# Altium project SLAVE_HW.PrjPcb (part 1 of 2)
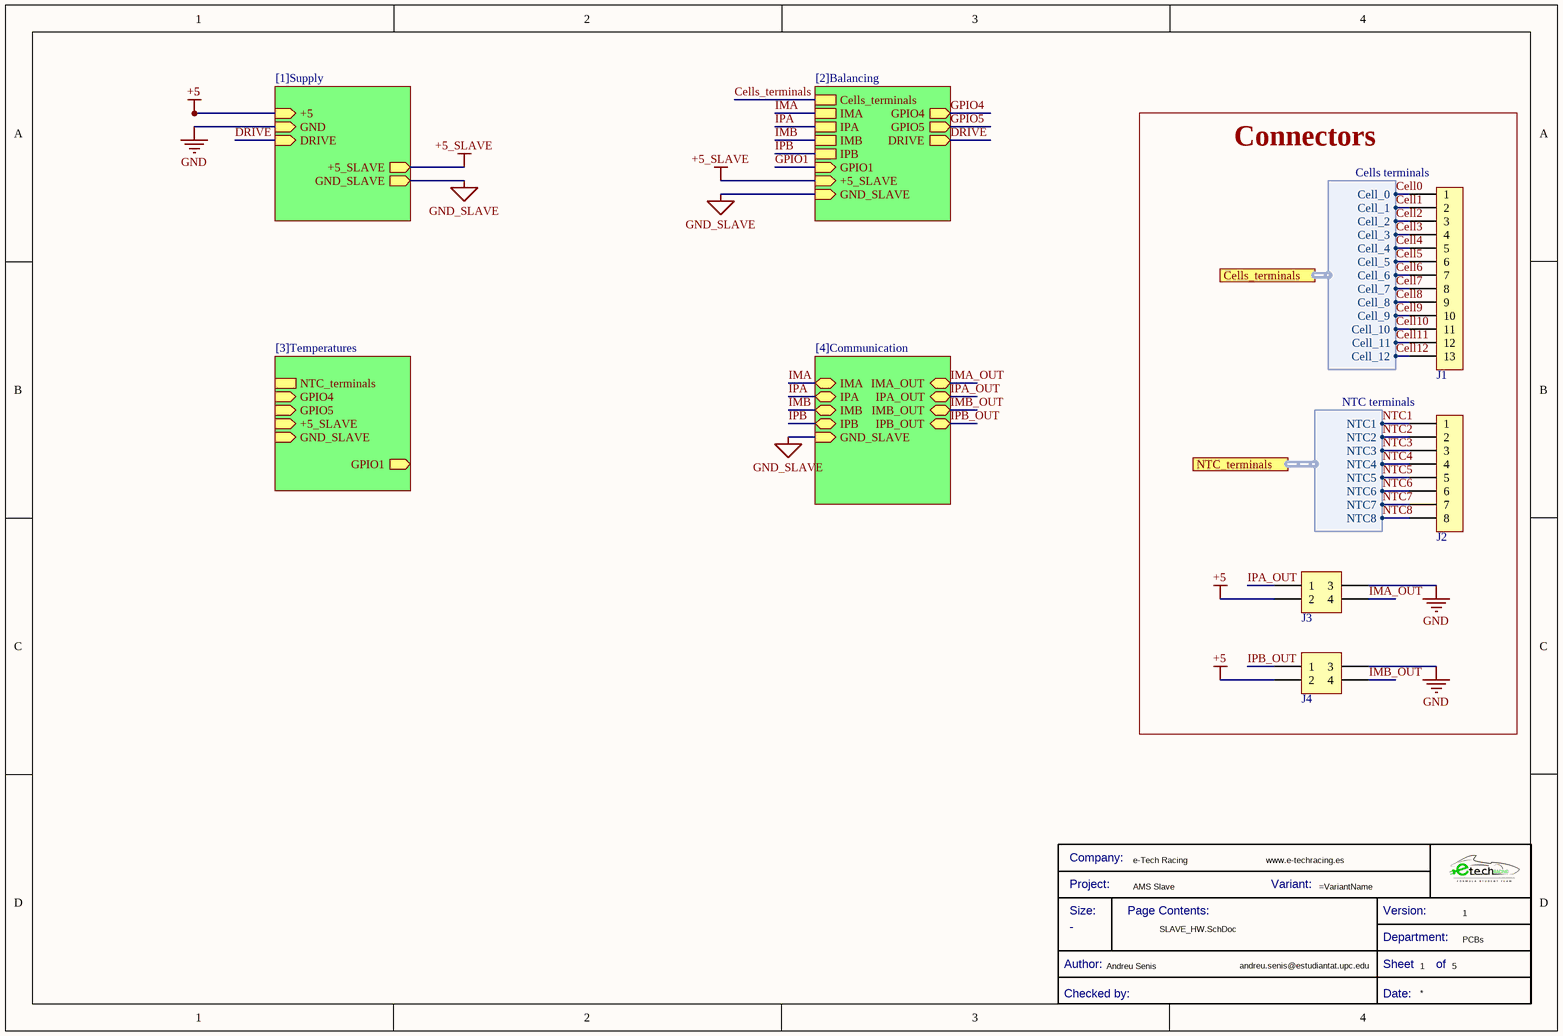
[diagram p0: SLAVE_HW.SchDoc]
Company: e-Tech Racing; Department: PCBs; DesignedbyURL: www.e-techracing.es; DesignerMail: andreu.senis@estudiantat.upc.edu; DesignerName: Andreu Senis; Project: AMS Slave; Version: 1
5 sheets, 128 parts. Net scope: hierarchical (ports join the sheet entries above them; power ports are global).
Board file: SLAVE_HW.PcbDoc
Sheets:
  SLAVE_HW.SchDoc
    Supply = [1]Supply.SchDoc
    Balancing = [2]Balancing.SchDoc
    Temperatures = [3]Temperatures.SchDoc
    Communication = [4]Communication.SchDoc

## Sheet SLAVE_HW.SchDoc
size A4; DocumentNumber: 1; SheetNumber: 1; SheetTotal: 5

### Parts
*  Title Block_template  (value not drawn)  (graphical)
J1  61301211121  [J_Pinheader_1x13]  (value not drawn)
J2  61301211121  [J_Pinheader_1x8]  (value not drawn)
J3  J_NanoFit_2x2  [J_NanoFit_2x2_v]  (value not drawn)
J4  J_NanoFit_2x2  [J_NanoFit_2x2_v]  (value not drawn)

### Blocks framed on the sheet
Connectors: J1-J4

### Sub-sheets
Balancing = [2]Balancing: Cells_terminals (harness Cells terminals), DRIVE (out), IMA, IPA, IMB, IPB, GPIO4 (out), GPIO5 (out), GPIO1 (in), +5_SLAVE (in), GND_SLAVE (in)
Communication = [4]Communication: IMA_OUT (bidir), IPA_OUT (bidir), IMB_OUT (bidir), IPB_OUT (bidir), IMA (bidir), IPA (bidir), IMB (bidir), IPB (bidir), GND_SLAVE (in)
Supply = [1]Supply: +5 (in), GND (in), +5_SLAVE (out), GND_SLAVE (out), DRIVE (in)
Temperatures = [3]Temperatures: NTC_terminals (harness NTC terminals), GPIO4 (in), GPIO5 (in), +5_SLAVE (in), GND_SLAVE (in), GPIO1 (out)

### Ports
Cells_terminals (harness Cells terminals), NTC_terminals (harness NTC terminals)

### Harnesses
Cells terminals: Cell_0, Cell_1, Cell_2, Cell_3, Cell_4, Cell_5, Cell_6, Cell_7, Cell_8, Cell_9, Cell_10, Cell_11, Cell_12
NTC terminals: NTC1, NTC2, NTC3, NTC4, NTC5, NTC6, NTC7, NTC8

### Nets
+5: J3.2 J4.2 ; sheet Supply/+5
+5_SLAVE: sheet Supply/+5_SLAVE, sheet Balancing/+5_SLAVE, sheet Temperatures/+5_SLAVE
GND: J3.3 J4.3 ; sheet Supply/GND
GND_SLAVE: sheet Supply/GND_SLAVE, sheet Balancing/GND_SLAVE, sheet Temperatures/GND_SLAVE, sheet Communication/GND_SLAVE  [project net C0]
Cell0: J1.1 ; port Cells_terminals.Cell_0
Cell1: J1.2 ; port Cells_terminals.Cell_1
Cell2: J1.3 ; port Cells_terminals.Cell_2
Cell3: J1.4 ; port Cells_terminals.Cell_3
Cell4: J1.5 ; port Cells_terminals.Cell_4
Cell5: J1.6 ; port Cells_terminals.Cell_5
Cell6: J1.7 ; port Cells_terminals.Cell_6
Cell7: J1.8 ; port Cells_terminals.Cell_7
Cell8: J1.9 ; port Cells_terminals.Cell_8
Cell9: J1.10 ; port Cells_terminals.Cell_9
Cell10: J1.11 ; port Cells_terminals.Cell_10
Cell11: J1.12 ; port Cells_terminals.Cell_11
Cell12: J1.13 ; port Cells_terminals.Cell_12
DRIVE: sheet Supply/DRIVE, sheet Balancing/DRIVE
IMA: sheet Balancing/IMA, sheet Communication/IMA
IMA_OUT: J3.4 ; sheet Communication/IMA_OUT
IMB: sheet Balancing/IMB, sheet Communication/IMB
IMB_OUT: J4.4 ; sheet Communication/IMB_OUT
IPA: sheet Balancing/IPA, sheet Communication/IPA
IPA_OUT: J3.1 ; sheet Communication/IPA_OUT
IPB: sheet Balancing/IPB, sheet Communication/IPB
IPB_OUT: J4.1 ; sheet Communication/IPB_OUT
NTC1: J2.1 ; port NTC_terminals.NTC1
NTC2: J2.2 ; port NTC_terminals.NTC2
NTC3: J2.3 ; port NTC_terminals.NTC3
NTC4: J2.4 ; port NTC_terminals.NTC4
NTC5: J2.5 ; port NTC_terminals.NTC5
NTC6: J2.6 ; port NTC_terminals.NTC6
NTC7: J2.7 ; port NTC_terminals.NTC7
NTC8: J2.8 ; port NTC_terminals.NTC8

### Notes on the sheet
- (in symbol Title Block_template) Company:; Project:; Variant:; Size:; Page Contents:; Version:; Department:; Author:; Sheet; of; Checked by:; Date:

### Library data of the parts
* = Title Block_template: Standard Title Block; .Creator: GP; Category: Title Block; .PCBcheck: GP; .SCHcheck: GP; Size: -
J1 = J_Pinheader_1x13: THT Vertical Pin Header WR-PHD, Pitch 2.54 mm, Single Row, 13 pins; Manufacturer 1: Wurth Electronics; Number of Positions: 12; Gender: Male; Connector Type: Male Pin; Pitch: 0.1inch; Supplier 1: Digi-Key; Manufacturer Part Number 1: 61301211121; RoHS: Yes; Category: Connectors; Stock 1: 2124; Pricing 1: 1=0,57000, 10=0,48400, 25=0,40400, 50=0,33700, 100=0,30600, 1000=0,27800 (USD); Mount: Through Hole; Contact Plating: Gold; Contact Material: Copper; Color: Black; Number of Rows: 1; Packaging: Bulk; Termination: Solder; Number of Contacts: 12; Contact Mating Length: 0.236inch; REACH SVHC: Unknown; RoHS Compliant: Yes; ComponentLink1URL: http://www.farnell.com/cad/1737268.pdf?src-supplier=Element14; ComponentLink1Description: http://www.farnell.com/cad/1737268.pdf?src-supplier=Element14; ComponentLink2URL: https://katalog.we-online.de/em/datasheet/6130xx11121.pdf?src-supplier=Digi-Key; ComponentLink2Description: https://katalog.we-online.de/em/datasheet/6130xx11121.pdf?src-supplier=Digi-Key
J2 = J_Pinheader_1x8: THT Vertical Pin Header WR-PHD, Pitch 2.54 mm, Single Row, 12 pins; Manufacturer 1: Wurth Electronics; Number of Positions: 12; Gender: Male; Connector Type: Male Pin; Pitch: 0.1inch; Supplier 1: Digi-Key; Manufacturer Part Number 1: 61301211121; RoHS: Yes; Category: Connectors; Stock 1: 2124; Pricing 1: 1=0,57000, 10=0,48400, 25=0,40400, 50=0,33700, 100=0,30600, 1000=0,27800 (USD); Mount: Through Hole; Contact Plating: Gold; Contact Material: Copper; Color: Black; Number of Rows: 1; Packaging: Bulk; Termination: Solder; Number of Contacts: 12; Contact Mating Length: 0.236inch; REACH SVHC: Unknown; RoHS Compliant: Yes; ComponentLink1URL: http://www.farnell.com/cad/1737268.pdf?src-supplier=Element14; ComponentLink1Description: http://www.farnell.com/cad/1737268.pdf?src-supplier=Element14; ComponentLink2URL: https://katalog.we-online.de/em/datasheet/6130xx11121.pdf?src-supplier=Digi-Key; ComponentLink2Description: https://katalog.we-online.de/em/datasheet/6130xx11121.pdf?src-supplier=Digi-Key
J3 J4 = J_NanoFit_2x2: Conn Nano-Fit Power HDR 4 POS 2.5mm Solder ST Through Hole 4 Terminal Single Port Tray; Manufacturer 1: Molex; Manufacturer Part Number 1: 1053101104; Supplier 1: Farnell; RoHS: Yes; Category: Uncategorized; Stock 1: 255; Pricing 1: 1=1,43000, 10=1,18000, 50=0,74900, 100=0,72900, 500=0,71400, 1000=0,70700 (EUR); ComponentLink1URL: https://www.molex.com/pdm_docs/ps/PS-105300-100-001.pdf?src-supplier=Digi-Key; ComponentLink1Description: https://www.molex.com/pdm_docs/ps/PS-105300-100-001.pdf?src-supplier=Digi-Key; Supplier Part Number 1: 2820681

## Sheet [1]Supply.SchDoc
size A4; DocumentNumber: 2; SheetNumber: 2; SheetTotal: 5
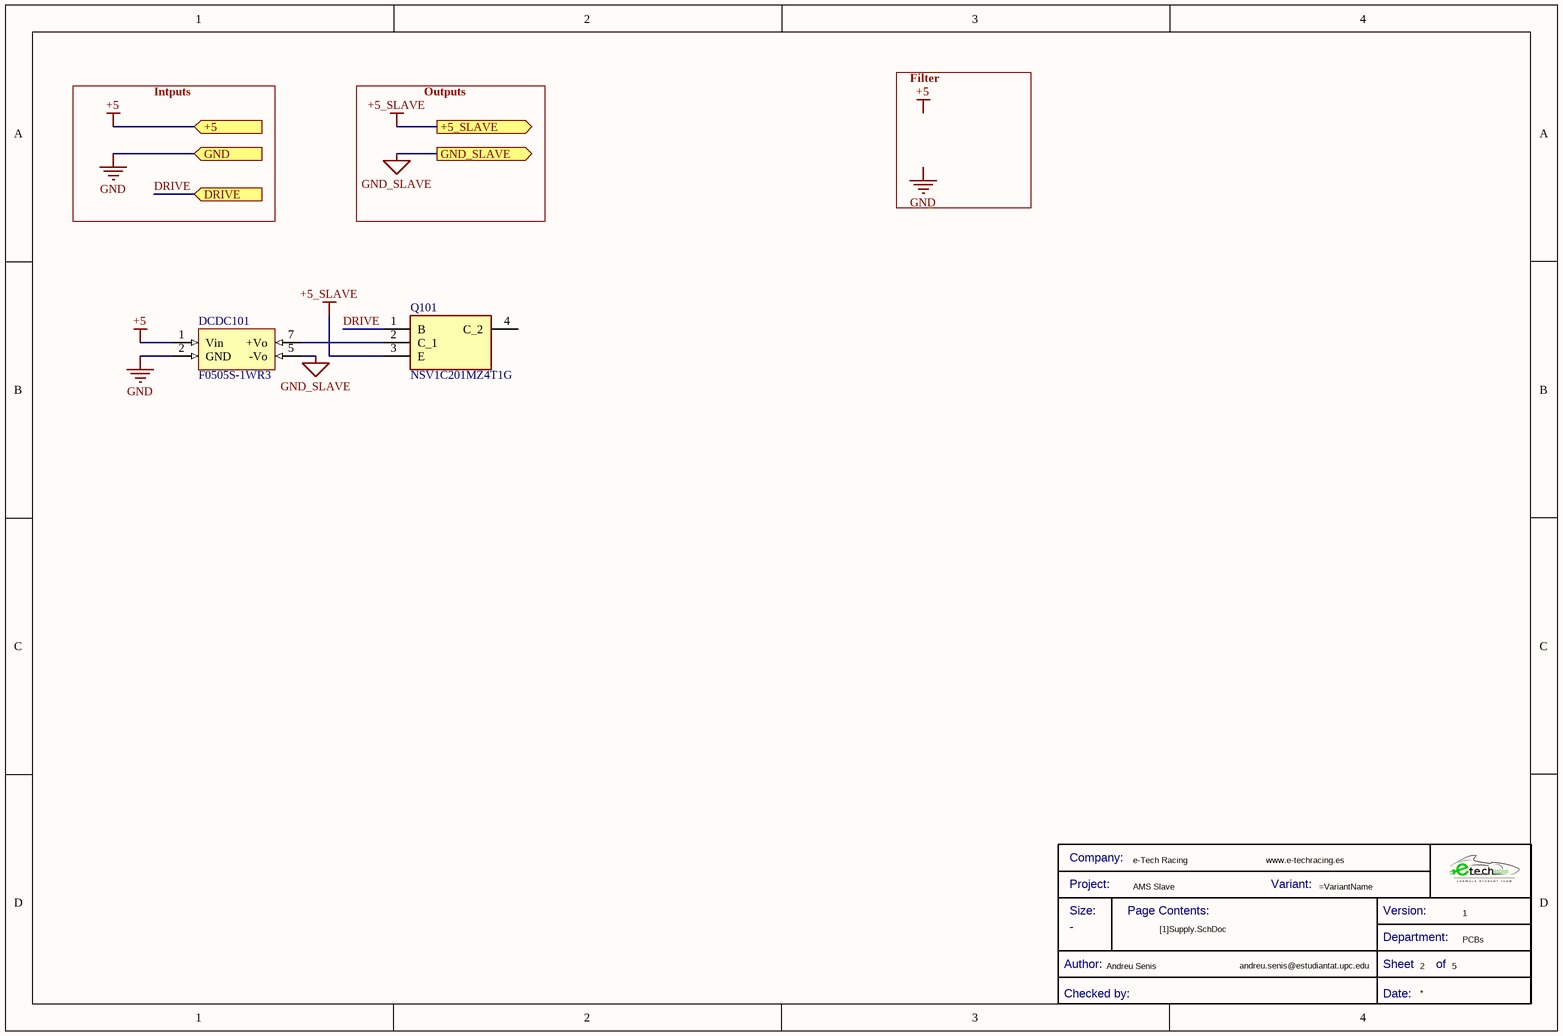
[diagram p1: [1]Supply.SchDoc]

### Parts
(Parts that share a designator on the sheet are numbered #1, #2 ... from top to bottom, then left to right.)
*?#1  Title Block_template  (value not drawn)  (graphical)
DCDC101  F0505S-1WR3  [F_S-1WR3]
Q101  NSV1C201MZ4T1G  [NSV1C201MZ4T1G]

### Ports
+5 (in), +5_SLAVE (out), DRIVE (in), GND (in), GND_SLAVE (out)

### Nets
+5: DCDC101.1(Vin) ; port +5
+5_SLAVE: Q101.3(E) ; port +5_SLAVE
GND: DCDC101.2(GND) ; port GND
GND_SLAVE: DCDC101.5(-Vo) ; port GND_SLAVE  [project net C0]
DRIVE: Q101.1(B) ; port DRIVE
NetDCDC101_7: DCDC101.7(+Vo) Q101.2(C_1)

Not connected (* = marked no-connect by the designer): Q101 4(C_2)

### Notes on the sheet
- Intputs
- Outputs
- Filter
- Labels drawn without touching a wire or pin: +5, GND
- (in symbol Title Block_template) Company:; Project:; Variant:; Size:; Page Contents:; Version:; Department:; Author:; Sheet; of; Checked by:; Date:

### Library data of the parts
*?#1 = Title Block_template: Standard Title Block; .Creator: GP; Category: Title Block; .PCBcheck: GP; .SCHcheck: GP; Size: -
DCDC101 = DCDC-5V/5V-0.2A
Q101 = TRT-NPN-2A-100V-0.8W-SOT

## Sheet [2]Balancing.SchDoc
size A4 portrait; DocumentNumber: 3; SheetNumber: 3; SheetTotal: 5
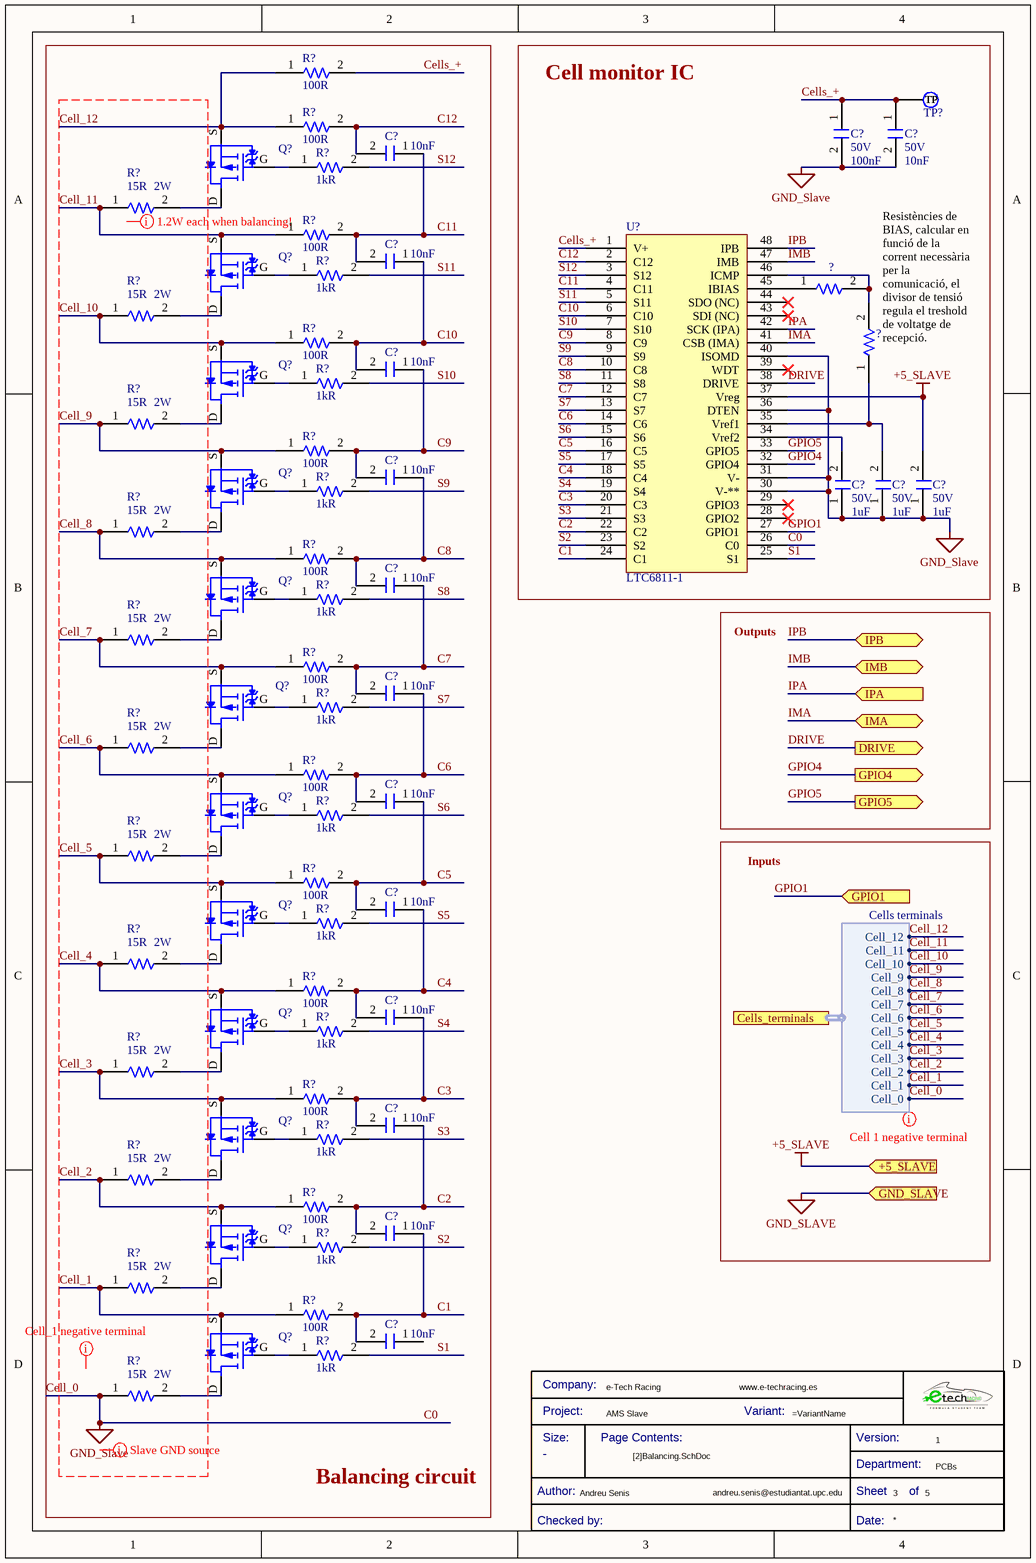
[diagram p2: [2]Balancing.SchDoc]

### Parts
(Parts that share a designator on the sheet are numbered #1, #2 ... from top to bottom, then left to right.)
*?#2  Title Block_template  (value not drawn)  (graphical)
?#1  ERJ-8GEYJ112V  [R1206FTK-W]  (value not drawn)
?#2  ERJ-8GEYJ112V  [R1206FTK-W]  (value not drawn)
C?#1  Voltage Rating: 50V  Capacitance: 100nF  [C0805FNPC-R]  (hidden comment: 885012207098)
C?#2  Voltage Rating: 50V  Capacitance: 10nF  [C0805FNPC-R]  (hidden comment: 885012207092)
C?#3  Capacitance: 10nF  [C0805FNPC-R]  (hidden comment: 885012207092)
C?#4  Capacitance: 10nF  [C0805FNPC-R]  (hidden comment: 885012207092)
C?#5  Capacitance: 10nF  [C0805FNPC-R]  (hidden comment: 885012207092)
C?#6  Capacitance: 10nF  [C0805FNPC-R]  (hidden comment: 885012207092)
C?#7  Voltage Rating: 50V  Capacitance: 1uF  [C0805FNPC-R]  (hidden comment: 885012207103)
C?#8  Voltage Rating: 50V  Capacitance: 1uF  [C0805FNPC-R]  (hidden comment: 885012207103)
C?#9  Voltage Rating: 50V  Capacitance: 1uF  [C0805FNPC-R]  (hidden comment: 885012207103)
C?#10  Capacitance: 10nF  [C0805FNPC-R]  (hidden comment: 885012207092)
C?#11  Capacitance: 10nF  [C0805FNPC-R]  (hidden comment: 885012207092)
C?#12  Capacitance: 10nF  [C0805FNPC-R]  (hidden comment: 885012207092)
C?#13  Capacitance: 10nF  [C0805FNPC-R]  (hidden comment: 885012207092)
C?#14  Capacitance: 10nF  [C0805FNPC-R]  (hidden comment: 885012207092)
C?#15  Capacitance: 10nF  [C0805FNPC-R]  (hidden comment: 885012207092)
C?#16  Capacitance: 10nF  [C0805FNPC-R]  (hidden comment: 885012207092)
C?#17  Capacitance: 10nF  [C0805FNPC-R]  (hidden comment: 885012207092)
Q?#1  BSS308PE  [TRT-PCH-2/30-BSS]  (value not drawn)
Q?#2  BSS308PE  [TRT-PCH-2/30-BSS]  (value not drawn)
Q?#3  BSS308PE  [TRT-PCH-2/30-BSS]  (value not drawn)
Q?#4  BSS308PE  [TRT-PCH-2/30-BSS]  (value not drawn)
Q?#5  BSS308PE  [TRT-PCH-2/30-BSS]  (value not drawn)
Q?#6  BSS308PE  [TRT-PCH-2/30-BSS]  (value not drawn)
Q?#7  BSS308PE  [TRT-PCH-2/30-BSS]  (value not drawn)
Q?#8  BSS308PE  [TRT-PCH-2/30-BSS]  (value not drawn)
Q?#9  BSS308PE  [TRT-PCH-2/30-BSS]  (value not drawn)
Q?#10  BSS308PE  [TRT-PCH-2/30-BSS]  (value not drawn)
Q?#11  BSS308PE  [TRT-PCH-2/30-BSS]  (value not drawn)
Q?#12  BSS308PE  [TRT-PCH-2/30-BSS]  (value not drawn)
R?#1  Resistance: 100R  [R0805FTK]  (hidden comment: CR0805-FX-1000ELF)
R?#2  Resistance: 100R  [R0805FTK]  (hidden comment: CR0805-FX-1000ELF)
R?#3  Resistance: 1kR  [R0805FTK]  (hidden comment: CR0805-JW-102ELF)
R?#4  value 15R  Max Power Dissipation: 2W  [R2512FTK]  (hidden comment: 352115RFT)
R?#5  Resistance: 100R  [R0805FTK]  (hidden comment: CR0805-FX-1000ELF)
R?#6  Resistance: 1kR  [R0805FTK]  (hidden comment: CR0805-JW-102ELF)
R?#7  value 15R  Max Power Dissipation: 2W  [R2512FTK]  (hidden comment: 352115RFT)
R?#8  Resistance: 100R  [R0805FTK]  (hidden comment: CR0805-FX-1000ELF)
R?#9  Resistance: 1kR  [R0805FTK]  (hidden comment: CR0805-JW-102ELF)
R?#10  value 15R  Max Power Dissipation: 2W  [R2512FTK]  (hidden comment: 352115RFT)
R?#11  Resistance: 100R  [R0805FTK]  (hidden comment: CR0805-FX-1000ELF)
R?#12  Resistance: 1kR  [R0805FTK]  (hidden comment: CR0805-JW-102ELF)
R?#13  value 15R  Max Power Dissipation: 2W  [R2512FTK]  (hidden comment: 352115RFT)
R?#14  Resistance: 100R  [R0805FTK]  (hidden comment: CR0805-FX-1000ELF)
R?#15  Resistance: 1kR  [R0805FTK]  (hidden comment: CR0805-JW-102ELF)
R?#16  value 15R  Max Power Dissipation: 2W  [R2512FTK]  (hidden comment: 352115RFT)
R?#17  Resistance: 100R  [R0805FTK]  (hidden comment: CR0805-FX-1000ELF)
R?#18  Resistance: 1kR  [R0805FTK]  (hidden comment: CR0805-JW-102ELF)
R?#19  value 15R  Max Power Dissipation: 2W  [R2512FTK]  (hidden comment: 352115RFT)
R?#20  Resistance: 100R  [R0805FTK]  (hidden comment: CR0805-FX-1000ELF)
R?#21  Resistance: 1kR  [R0805FTK]  (hidden comment: CR0805-JW-102ELF)
R?#22  value 15R  Max Power Dissipation: 2W  [R2512FTK]  (hidden comment: 352115RFT)
R?#23  Resistance: 100R  [R0805FTK]  (hidden comment: CR0805-FX-1000ELF)
R?#24  Resistance: 1kR  [R0805FTK]  (hidden comment: CR0805-JW-102ELF)
R?#25  value 15R  Max Power Dissipation: 2W  [R2512FTK]  (hidden comment: 352115RFT)
R?#26  Resistance: 100R  [R0805FTK]  (hidden comment: CR0805-FX-1000ELF)
R?#27  Resistance: 1kR  [R0805FTK]  (hidden comment: CR0805-JW-102ELF)
R?#28  value 15R  Max Power Dissipation: 2W  [R2512FTK]  (hidden comment: 352115RFT)
R?#29  Resistance: 100R  [R0805FTK]  (hidden comment: CR0805-FX-1000ELF)
R?#30  Resistance: 1kR  [R0805FTK]  (hidden comment: CR0805-JW-102ELF)
R?#31  value 15R  Max Power Dissipation: 2W  [R2512FTK]  (hidden comment: 352115RFT)
R?#32  Resistance: 100R  [R0805FTK]  (hidden comment: CR0805-FX-1000ELF)
R?#33  Resistance: 1kR  [R0805FTK]  (hidden comment: CR0805-JW-102ELF)
R?#34  value 15R  Max Power Dissipation: 2W  [R2512FTK]  (hidden comment: 352115RFT)
R?#35  Resistance: 100R  [R0805FTK]  (hidden comment: CR0805-FX-1000ELF)
R?#36  Resistance: 1kR  [R0805FTK]  (hidden comment: CR0805-JW-102ELF)
R?#37  value 15R  Max Power Dissipation: 2W  [R2512FTK]  (hidden comment: 352115RFT)
TP?  TestPoint  [TestPoint]  (value not drawn)  (no BOM)
U?  LTC6811-1  [U_LTC6811G-2]

### Blocks framed on the sheet
Balancing circuit: C?#3-C?#6 C?#10-C?#17 Q?#1-Q?#12 R?#1-R?#37
Cell monitor IC: ?#1 ?#2 C?#1 C?#2 C?#7-C?#9 TP? U?

### Ports
+5_SLAVE (in), Cells_terminals (harness Cells terminals), DRIVE (out), GND_SLAVE (in), GPIO1 (in), GPIO4 (out), GPIO5 (out), IMA (bidir), IMB (bidir), IPA (in), IPB (bidir)

### Harnesses
Cells terminals: Cell_0, Cell_1, Cell_2, Cell_3, Cell_4, Cell_5, Cell_6, Cell_7, Cell_8, Cell_9, Cell_10, Cell_11, Cell_12

### Nets
+5_SLAVE: C?#9.2 U?.37(Vreg) ; port +5_SLAVE
C0: C?#1.2 C?#2.2 C?#7.1 C?#8.1 C?#9.1 R?#37.1 U?.26(C0) U?.30(V-**) U?.31(V-) U?.36(DTEN) U?.40(ISOMD) ; port GND_SLAVE, port Cells_terminals.Cell_0  [also labelled Cell_0, GND_Slave]
C1: C?#16.1 C?#17.2 R?#35.2 U?.24(C1)
C2: C?#15.1 C?#16.2 R?#32.2 U?.22(C2)
C3: C?#14.1 C?#15.2 R?#29.2 U?.20(C3)
C4: C?#13.1 C?#14.2 R?#26.2 U?.18(C4)
C5: C?#12.1 C?#13.2 R?#23.2 U?.16(C5)
C6: C?#11.1 C?#12.2 R?#20.2 U?.14(C6)
C7: C?#10.1 C?#11.2 R?#17.2 U?.12(C7)
C8: C?#6.1 C?#10.2 R?#14.2 U?.10(C8)
C9: C?#5.1 C?#6.2 R?#11.2 U?.8(C9)
C10: C?#4.1 C?#5.2 R?#8.2 U?.6(C10)
C11: C?#3.1 C?#4.2 R?#5.2 U?.4(C11)
C12: C?#3.2 R?#2.2 U?.2(C12)
Cell_1: Q?#12.S R?#34.1 R?#35.1 ; port Cells_terminals.Cell_1
Cell_2: Q?#11.S R?#31.1 R?#32.1 ; port Cells_terminals.Cell_2
Cell_3: Q?#10.S R?#28.1 R?#29.1 ; port Cells_terminals.Cell_3
Cell_4: Q?#9.S R?#25.1 R?#26.1 ; port Cells_terminals.Cell_4
Cell_5: Q?#8.S R?#22.1 R?#23.1 ; port Cells_terminals.Cell_5
Cell_6: Q?#7.S R?#19.1 R?#20.1 ; port Cells_terminals.Cell_6
Cell_7: Q?#6.S R?#16.1 R?#17.1 ; port Cells_terminals.Cell_7
Cell_8: Q?#5.S R?#13.1 R?#14.1 ; port Cells_terminals.Cell_8
Cell_9: Q?#4.S R?#10.1 R?#11.1 ; port Cells_terminals.Cell_9
Cell_10: Q?#3.S R?#7.1 R?#8.1 ; port Cells_terminals.Cell_10
Cell_11: Q?#2.S R?#4.1 R?#5.1 ; port Cells_terminals.Cell_11
Cell_12: Q?#1.S R?#1.1 R?#2.1 ; port Cells_terminals.Cell_12
Cells_+: C?#1.1 C?#2.1 R?#1.2 TP?.1(TP) U?.1(V+)
DRIVE: U?.38(DRIVE) ; port DRIVE
GPIO1: U?.27(GPIO1) ; port GPIO1
GPIO4: U?.32(GPIO4) ; port GPIO4
GPIO5: U?.33(GPIO5) ; port GPIO5
IMA: U?.41(CSB_(IMA)) ; port IMA
IMB: U?.47(IMB) ; port IMB
IPA: U?.42(SCK_(IPA)) ; port IPA
IPB: U?.48(IPB) ; port IPB
S1: R?#36.2 U?.25(S1)
S2: R?#33.2 U?.23(S2)
S3: R?#30.2 U?.21(S3)
S4: R?#27.2 U?.19(S4)
S5: R?#24.2 U?.17(S5)
S6: R?#21.2 U?.15(S6)
S7: R?#18.2 U?.13(S7)
S8: R?#15.2 U?.11(S8)
S9: R?#12.2 U?.9(S9)
S10: R?#9.2 U?.7(S10)
S11: R?#6.2 U?.5(S11)
S12: R?#3.2 U?.3(S12)
Net?#1_1: ?#1.1 U?.45(IBIAS)
Net?#1_2: ?#1.2 ?#2.2 U?.46(ICMP)
Net?#2_1: ?#2.1 C?#8.2 U?.35(Vref1)
NetC?#7_2: C?#7.2 U?.34(Vref2)
NetQ?#1_D: Q?#1.D R?#4.2
NetQ?#1_G: Q?#1.G R?#3.1
NetQ?#2_D: Q?#2.D R?#7.2
NetQ?#2_G: Q?#2.G R?#6.1
NetQ?#3_D: Q?#3.D R?#10.2
NetQ?#3_G: Q?#3.G R?#9.1
NetQ?#4_D: Q?#4.D R?#13.2
NetQ?#4_G: Q?#4.G R?#12.1
NetQ?#5_D: Q?#5.D R?#16.2
NetQ?#5_G: Q?#5.G R?#15.1
NetQ?#6_D: Q?#6.D R?#19.2
NetQ?#6_G: Q?#6.G R?#18.1
NetQ?#7_D: Q?#7.D R?#22.2
NetQ?#7_G: Q?#7.G R?#21.1
NetQ?#8_D: Q?#8.D R?#25.2
NetQ?#8_G: Q?#8.G R?#24.1
NetQ?#9_D: Q?#9.D R?#28.2
NetQ?#9_G: Q?#9.G R?#27.1
NetQ?#10_D: Q?#10.D R?#31.2
NetQ?#10_G: Q?#10.G R?#30.1
NetQ?#11_D: Q?#11.D R?#34.2
NetQ?#11_G: Q?#11.G R?#33.1
NetQ?#12_D: Q?#12.D R?#37.2
NetQ?#12_G: Q?#12.G R?#36.1

Not connected (* = marked no-connect by the designer): C?#17 1; U? 28(GPIO2)* 29(GPIO3)* 39(WDT)* 43(SDI_(NC))* 44(SDO_(NC))*

### Layout directives
mark named Slave GND source: Cell_1, Cell_2, Cell_3, Cell_4, Cell_5, Cell_6, Cell_7, Cell_8, Cell_9, Cell_10, Cell_11, Cell_12, GND_Slave
mark named 1.2W each when balancing!: Cell_1, Cell_2, Cell_3, Cell_4, Cell_5, Cell_6, Cell_7, Cell_8, Cell_9, Cell_10, Cell_11, Cell_12, GND_Slave
mark named Cell_1 negative terminal: Cell_1, Cell_2, Cell_3, Cell_4, Cell_5, Cell_6, Cell_7, Cell_8, Cell_9, Cell_10, Cell_11, Cell_12, GND_Slave
mark named Cell 1 negative terminal: C0

### Notes on the sheet
- (near ?#2) Resistències de BIAS, calcular en funció de la corrent necessària per la comunicació, el divisor de tensió regula el treshold de voltatge de recepció.
- Outputs
- Inputs
- (in symbol Title Block_template) Company:; Project:; Variant:; Size:; Page Contents:; Version:; Department:; Author:; Sheet; of; Checked by:; Date:

### Library data of the parts
*?#2 = Title Block_template: Standard Title Block; .Creator: GP; Category: Title Block; .PCBcheck: GP; .SCHcheck: GP; Size: -
?#1 ?#2 = R1k1-1206FTK: Res Thick Film 1206 1.1K Ohm 5% 0.25W ±200ppm/°C Molded SMD Punched Carrier T/R; Manufacturer: Panasonic; Power Rating: 250mW; Voltage Rating: 200V; .Creator: DO; Supplier 1: Newark; Manufacturer Part Number: ERJ-8GEYJ112V; RoHS: Yes; Category: Chip SMD Resistors; Stock 1: 9980; Pricing 1: 10=0,12700, 25=0,10100, 50=0,07500, 100=0,05000 (USD); Mount: Surface Mount; Case/Package: 1206; Contact Plating: Tin; Case Code (Metric): 3216; Case Code (Imperial): 1206; Min Operating Temperature: -55°C; Max Operating Temperature: 155°C; Tolerance: 5%; Resistor Type: Thick Film; Temperature Coefficient: 200ppm/°C; Packaging: Tape and Reel; Package Quantity: 1; Number of Terminations: 2; Max Power Dissipation: 250mW; Voltage Rating (DC): 200V; Features: Automotive AEC-Q200; Series: ERJ; Resistance Tolerance: 5%; Construction: Rectangular; Length: 3.2mm; Width: 0.063inch; Height: 0.028inch; Depth: 1.6mm; Radiation Hardening: No; REACH SVHC: No SVHC; Military Standard: Not; Lead Free: Lead Free; RoHS Compliant: Yes; ComponentLink1URL: https://datasheet.ciiva.com/5868/1500035-5868231.pdf?src-supplier=Farnell; ComponentLink1Description: https://datasheet.ciiva.com/5868/1500035-5868231.pdf?src-supplier=Farnell; ComponentLink2URL: https://datasheet.ciiva.com/17215/aoa0000ce1-17215127.pdf?src-supplier=Avnet+Europe; ComponentLink2Description: https://datasheet.ciiva.com/17215/aoa0000ce1-17215127.pdf?src-supplier=Avnet+Europe; ComponentLink3URL: https://datasheet.ciiva.com/46387/1500035-46387306.pdf?src-supplier=Element14; ComponentLink3Description: https://datasheet.ciiva.com/46387/1500035-46387306.pdf?src-supplier=Element14; ComponentLink4URL: https://datasheet.ciiva.com/9198/aoa0000ce1-9198847.pdf?src-supplier=Avnet; ComponentLink4Description: https://datasheet.ciiva.com/9198/aoa0000ce1-9198847.pdf?src-supplier=Avnet; Supplier Part Number 1: 63W1481; ComponentLink5Description: Where buy it; ComponentLink5URL: https://www.mouser.es/ProductDetail/Panasonic/ERJ-8GEYJ112V?qs=1VWA5LkbEaqqGx1BXqOkLA%3D%3D
C?#1 = C100n-50V-0805FNPC-X7R: Cap, 0.1ΜF, 50V, 10%, X7R, 0805; Manufacturer 1: Wurth Electronics; .Creator: DR; Supplier 1: RSComponents; Manufacturer Part Number 1: 885012207098; RoHS: Yes; Category: Ceramic Capacitors; Stock 1: 8000; Pricing 1: 100=0,10200, 500=0,07100, 2000=0,06100 (GBP); Mount: Surface Mount; Case/Package: 0805; Case Code (Metric): 2012; Case Code (Imperial): 0805; Min Operating Temperature: -55°C; Max Operating Temperature: 125°C; Packaging: Cut Tape; Dielectric: X7R; Tolerance: 10%; Voltage Rating (DC): 50V; Length: 0.079inch; Width: 0.049inch; Thickness: 0.035inch; REACH SVHC: Unknown; RoHS Compliant: Yes; ComponentLink1URL: http://www.farnell.com/datasheets/1958498.pdf?src-supplier=Farnell; ComponentLink1Description: http://www.farnell.com/datasheets/1958498.pdf?src-supplier=Farnell; ComponentLink2URL: http://www.farnell.com/datasheets/1958498.pdf?src-supplier=Element14; ComponentLink2Description: http://www.farnell.com/datasheets/1958498.pdf?src-supplier=Element14; ComponentLink3URL: https://katalog.we-online.de/pbs/datasheet/885012207098.pdf?src-supplier=Digi-Key; ComponentLink3Description: https://katalog.we-online.de/pbs/datasheet/885012207098.pdf?src-supplier=Digi-Key; ComponentLink4URL: http://www.farnell.com/datasheets/1958498.pdf?src-supplier=Newark; ComponentLink4Description: http://www.farnell.com/datasheets/1958498.pdf?src-supplier=Newark; Supplier Part Number 1: 1813493
C?#2-C?#6 C?#10-C?#17 = C10n-50V-0805FNPC-X7R: Cap, 0.01ΜF, 50V, 10%, X7R, 0805; Manufacturer 1: Wurth Electronics; .Creator: DR; Supplier 1: RSComponents; Manufacturer Part Number 1: 885012207092; RoHS: Yes; Category: Ceramic Capacitors; Stock 1: 1; Pricing 1: 4000=0,03200, 12000=0,03100 (USD); Mount: Surface Mount; Case/Package: 0805; Case Code (Metric): 2012; Case Code (Imperial): 0805; Min Operating Temperature: -55°C; Max Operating Temperature: 125°C; Packaging: Cut Tape; Dielectric: X7R; Tolerance: 10%; Voltage Rating (DC): 50V; Length: 0.079inch; Width: 0.049inch; Thickness: 0.035inch; REACH SVHC: Unknown; RoHS Compliant: Yes; ComponentLink1URL: http://www.farnell.com/datasheets/1958497.pdf?src-supplier=Farnell; ComponentLink1Description: http://www.farnell.com/datasheets/1958497.pdf?src-supplier=Farnell; ComponentLink2URL: http://www.farnell.com/datasheets/1958497.pdf?src-supplier=Element14; ComponentLink2Description: http://www.farnell.com/datasheets/1958497.pdf?src-supplier=Element14; ComponentLink3URL: http://www.farnell.com/datasheets/1958497.pdf?src-supplier=Newark; ComponentLink3Description: http://www.farnell.com/datasheets/1958497.pdf?src-supplier=Newark; ComponentLink4URL: https://katalog.we-online.de/pbs/datasheet/885012207092.pdf?src-supplier=Digi-Key; ComponentLink4Description: https://katalog.we-online.de/pbs/datasheet/885012207092.pdf?src-supplier=Digi-Key; Supplier Part Number 1: 1813941
  C?#3-C?#6 C?#10-C?#17: Voltage Rating: 50V
C?#7-C?#9 = C1u-50V-0805FNPC-X7R: Multilayer Ceramic Capacitor, Wcap-Csgp Series, 1 F, 10%, X7R, 50 V, 0805 [2012 Metric] Rohs Compliant: Yes; Manufacturer 1: Wurth Electronics; .Creator: GP; Supplier 1: RSComponents; Manufacturer Part Number 1: 885012207103; RoHS: Yes; Category: Ceramic Capacitors; Stock 1: 5100; Pricing 1: 50=0,27200, 250=0,25300, 500=0,22800, 1250=0,20100, 2500=0,17100 (GBP); Mount: Surface Mount; Case/Package: 0805; Case Code (Metric): 2012; Case Code (Imperial): 0805; Min Operating Temperature: -55°C; Max Operating Temperature: 85°C; Packaging: Cut Tape; Dielectric: X7R; Tolerance: 10%; Voltage Rating (DC): 50V; Length: 0.079inch; Width: 0.049inch; Thickness: 0.053inch; REACH SVHC: Unknown; RoHS Compliant: Yes; ComponentLink1URL: http://www.farnell.com/datasheets/1958501.pdf?src-supplier=Farnell; ComponentLink1Description: http://www.farnell.com/datasheets/1958501.pdf?src-supplier=Farnell; ComponentLink2URL: http://www.farnell.com/datasheets/1958501.pdf?src-supplier=Element14; ComponentLink2Description: http://www.farnell.com/datasheets/1958501.pdf?src-supplier=Element14; ComponentLink3URL: https://katalog.we-online.de/pbs/datasheet/885012107003.pdf?src-supplier=Digi-Key; ComponentLink3Description: https://katalog.we-online.de/pbs/datasheet/885012107003.pdf?src-supplier=Digi-Key; ComponentLink4URL: http://www.farnell.com/datasheets/1958501.pdf?src-supplier=Newark; ComponentLink4Description: http://www.farnell.com/datasheets/1958501.pdf?src-supplier=Newark; Supplier Part Number 1: 1813523
Q?#1-Q?#12 = TRT-PCH-2/30-BSS: Infineon’s highly innovative OptiMOS™ families include p-channel power MOSFETs, SOT-23-3, RoHS; Manufacturer Part Number: BSS308PEH6327; Continuous Drain Current (ID): 2A; Input Capacitance: 500pF; Drain to Source Voltage (Vdss): 30V; Max Power Dissipation: 500mW; Gate to Source Voltage (Vgs): 20V; Rds On Max: 80mR; Rise Time: 7.7ns; Turn-Off Delay Time: 15.3ns; Fall Time: 2.8ns; Turn-On Delay Time: 5.6ns; Threshold Voltage: -1.5V; .Creator: DO; Supplier 1: RSComponents; Manufacturer: Infineon; RoHS: Yes; Category: MOSFETs; Stock 1: 4000; Pricing 1: 50=0,50300, 100=0,26400, 250=0,25900, 500=0,25200, 1000=0,24700 (USD); Mount: Surface Mount; Case/Package: TO-236-3; Number of Pins: 3; Min Operating Temperature: -55°C; Max Operating Temperature: 150°C; Packaging: Tape and Reel; Package Quantity: 1; Series: OptiMOS™; REACH SVHC: No SVHC; ComponentLink1URL: https://datasheet.ciiva.com/6379/infineon-bss308pe-ds-v02-03-en-6379920.pdf?src-supplier=Digi-Key; ComponentLink1Description: datasheet; ComponentLink2URL: https://datasheet.ciiva.com/11171/infineon-bss308pe-ds-v02-03-en-11171385.pdf?src-supplier=Avnet; ComponentLink2Description: https://datasheet.ciiva.com/11171/infineon-bss308pe-ds-v02-03-en-11171385.pdf?src-supplier=Avnet; Supplier Part Number 1: 8235500
R?#1 R?#2 R?#5 R?#8 R?#11 R?#14 R?#17 R?#20 R?#23 R?#26 R?#29 R?#32 R?#35 = R100-0805FTK: Res Thick Film 0805 100 Ohm 1% 1/8W ±100ppm/°C Molded SMD SMD Paper Tape on Plastic Reel; Manufacturer 1: Bourns; Power Rating: 125mW; Voltage Rating: 150V; .Creator: DR; Supplier 1: Arrow Electronics; Manufacturer Part Number 1: CR0805-FX-1000ELF; RoHS: Yes; Category: Chip SMD Resistors; Stock 1: 49802; Pricing 1: 1=0,05840, 10=0,03430, 25=0,01780, 100=0,00750, 250=0,00560, 500=0,00490, 3000=0,00470 (USD); Mount: Surface Mount; Case/Package: 0805; Number of Pins: 2; Contact Plating: Tin; Case Code (Imperial): 0805; Case Code (Metric): 2012; Min Operating Temperature: -55°C; Max Operating Temperature: 155°C; Tolerance: 1%; Resistor Type: Thick Film; Temperature Coefficient: 100ppm/°C; Packaging: Tape and Reel; Package Quantity: 1; Termination: SMD/SMT; Number of Terminations: 2; Max Power Dissipation: 125mW; Voltage Rating (DC): 150V; Features: Moisture Resistant; Series: CR0805; Resistance Tolerance: 1%; Construction: Rectangular; Technology: THICK FILM; Length: 2mm; Width: 1.25mm; Height: 0.5mm; Depth: 1.25mm; Thickness: 508um; Radiation Hardening: No; REACH SVHC: No SVHC; Military Standard: Not; RoHS Compliant: Yes; ComponentLink1URL: https://datasheet.ciiva.com/11809/0900766b80fcdb72-11809178.pdf?src-supplier=RSComponents; ComponentLink1Description: https://datasheet.ciiva.com/11809/0900766b80fcdb72-11809178.pdf?src-supplier=RSComponents; ComponentLink2URL: https://datasheet.ciiva.com/6547/chpreztr-6547413.pdf?src-supplier=Digi-Key; ComponentLink2Description: https://datasheet.ciiva.com/6547/chpreztr-6547413.pdf?src-supplier=Digi-Key; ComponentLink3URL: https://datasheet.ciiva.com/6547/chpreztr-6547414.pdf?src-supplier=Digi-Key; ComponentLink3Description: https://datasheet.ciiva.com/6547/chpreztr-6547414.pdf?src-supplier=Digi-Key; ComponentLink4URL: https://datasheet.ciiva.com/6547/chpreztr-6547415.pdf?src-supplier=Digi-Key; ComponentLink4Description: https://datasheet.ciiva.com/6547/chpreztr-6547415.pdf?src-supplier=Digi-Key; ComponentLink5URL: https://datasheet.ciiva.com/9120/chpreztr-9120744.pdf?src-supplier=Avnet; ComponentLink5Description: https://datasheet.ciiva.com/9120/chpreztr-9120744.pdf?src-supplier=Avnet; Supplier Part Number 1: CR0805-FX-1000ELF
R?#3 R?#6 R?#9 R?#12 R?#15 R?#18 R?#21 R?#24 R?#27 R?#30 R?#33 R?#36 = R1k-0805FTK: Res Thick Film 0805 1K Ohm 5% 1/8W ±200ppm/°C Molded SMD SMD Paper Tape on Plastic Reel; Manufacturer 1: Bourns; Voltage Rating (DC): 150V; Power Rating: 125mW; .Creator: GP; Supplier 1: Arrow Electronics; Manufacturer Part Number 1: CR0805-JW-102ELF; RoHS: Yes; Category: Chip SMD Resistors; Stock 1: 27510; Pricing 1: 1=0,05930, 10=0,03510, 25=0,01790, 100=0,00800, 250=0,00790, 500=0,00590, 1000=0,00360, 3000=0,00350, 6000=0,00250 (USD); Mount: Surface Mount; Case/Package: 0805; Number of Pins: 2; Contact Plating: Tin; Case Code (Metric): 2012; Case Code (Imperial): 0805; Min Operating Temperature: -55°C; Max Operating Temperature: 155°C; Resistor Type: Thick Film; Tolerance: 5%; Temperature Coefficient: 200ppm/°C; Features: Moisture Resistant; Package Quantity: 1; Packaging: Tape and Reel; Voltage Rating: 150V; Number of Terminations: 2; Termination: SMD/SMT; Max Power Dissipation: 125mW; Length: 2mm; Width: 1.25mm; Height: 0.5mm; Thickness: 508um; Depth: 1.25mm; Radiation Hardening: No; Lead Free: Lead Free; REACH SVHC: No SVHC; Military Standard: Not; ComponentLink1URL: https://datasheet.ciiva.com/11821/0900766b80fcdb72-11821134.pdf?src-supplier=RSComponents; ComponentLink1Description: https://datasheet.ciiva.com/11821/0900766b80fcdb72-11821134.pdf?src-supplier=RSComponents; ComponentLink2URL: https://datasheet.ciiva.com/15225/getdatasheetpartid-78155-15225381.pdf?src-supplier=Verical; ComponentLink2Description: https://datasheet.ciiva.com/15225/getdatasheetpartid-78155-15225381.pdf?src-supplier=Verical; ComponentLink3URL: https://datasheet.ciiva.com/22693/1902866-22693253.pdf?src-supplier=Element14; ComponentLink3Description: https://datasheet.ciiva.com/22693/1902866-22693253.pdf?src-supplier=Element14; ComponentLink4URL: https://datasheet.ciiva.com/7986/1856384-7986184.pdf?src-supplier=Element14; ComponentLink4Description: https://datasheet.ciiva.com/7986/1856384-7986184.pdf?src-supplier=Element14; ComponentLink5URL: https://datasheet.ciiva.com/7985/1856384-7985867.pdf?src-supplier=Element14; ComponentLink5Description: https://datasheet.ciiva.com/7985/1856384-7985867.pdf?src-supplier=Element14; ComponentLink6URL: https://datasheet.ciiva.com/30242/159chpreztr-30242765.pdf?src-supplier=Onlinecomponents.com; ComponentLink6Description: https://datasheet.ciiva.com/30242/159chpreztr-30242765.pdf?src-supplier=Onlinecomponents.com; ComponentLink7URL: https://datasheet.ciiva.com/6547/chpreztr-6547359.pdf?src-supplier=Digi-Key; ComponentLink7Description: https://datasheet.ciiva.com/6547/chpreztr-6547359.pdf?src-supplier=Digi-Key; Supplier Part Number 1: CR0805-JW-102ELF
R?#4 R?#7 R?#10 R?#13 R?#16 R?#19 R?#22 R?#25 R?#28 R?#31 R?#34 R?#37 = R15-2512FTK: Res Thick Film 2512 15 Ohm 1% 2W ±100ppm/C Pad SMD T/R; Manufacturer 1: TE Connectivity; Temperature Coefficient: 100ppm/°C; Voltage Rating: 250V; Number of Resistors: 1; .Creator: DR; ComponentLink1Description: Datasheet; ComponentLink1URL: https://docs.rs-online.com/8bc1/0900766b81096b90.pdf; ComponentLink2Description: Where buy it; ComponentLink2URL: https://es.rs-online.com/web/p/resistencias-de-montaje-en-superficie/7551110; Supplier 1: RSComponents; Manufacturer Part Number 1: 352115RFT; RoHS: Yes; Category: Chip SMD Resistors; Stock 1: 1; Pricing 1: 10=0,64300, 250=0,62200, 1000=0,60000, 2000=0,55400, 2500=0,52100 (USD); Mount: Surface Mount; Case/Package: 2512; Case Code (Metric): 6432; Case Code (Imperial): 2512; Min Operating Temperature: -55°C; Max Operating Temperature: 155°C; Packaging: Tape and Reel; Tolerance: 1%; Resistor Type: Thick Film,Power resistor; Number of Terminations: 2; Termination: Solder; Voltage Rating (DC): 250V; Features: Automotive AEC-Q200; Series: 3521, CGS; Technology: THICK FILM; Resistance Tolerance: 1%; Length: 6.3mm; Height: 0.55mm; Depth: 3.2mm; RoHS Compliant: Yes; REACH SVHC: No SVHC; ELV: Compliant; ComponentLink3URL: https://datasheet.ciiva.com/25610/0900766b81096b90-25610033.pdf?src-supplier=RSComponents; ComponentLink3Description: https://datasheet.ciiva.com/25610/0900766b81096b90-25610033.pdf?src-supplier=RSComponents; ComponentLink4URL: https://datasheet.ciiva.com/46391/1610601-46391493.pdf?src-supplier=Element14; ComponentLink4Description: https://datasheet.ciiva.com/46391/1610601-46391493.pdf?src-supplier=Element14; ComponentLink5URL: https://datasheet.ciiva.com/7657/1610601-7657542.pdf?src-supplier=Element14; ComponentLink5Description: https://datasheet.ciiva.com/7657/1610601-7657542.pdf?src-supplier=Element14; Supplier Part Number 1: 7551110P
TP? = TestPoint: Test Point 1x1 mm; .Creator: GP; Category: TestPoint; .PCBcheck: GP; .SCHcheck: GP
U? = U_LTC6811-1: Sc-Automotive Multicell Battery Stack Monitor With Addressable Isospi Interface; Manufacturer 1: Analog Devices; .Creator: GP; ComponentLink1URL: https://www.analog.com/media/en/technical-documentation/data-sheets/ltc6811-1-6811-2.pdf; ComponentLink1Description: Datasheet; ComponentLink2Description: Where buy it; ComponentLink2URL: https://www.mouser.es/ProductDetail/Analog-Devices/LTC6811IG-23ZZTRPBF?qs=byeeYqUIh0NWJgxDt7RX5g%3D%3D; Supplier 1: Digi-Key; Category: Battery Management; Pricing 1: 1=21,46000, 10=19,72200, 25=18,90400, 100=16,65600, 250=15,90600 (USD); RoHS Compliant: Yes; ComponentLink3URL: http://www.linear.com/docs/55980?src-supplier=Digi-Key; ComponentLink3Description: http://www.linear.com/docs/55980?src-supplier=Digi-Key; ComponentLink4URL: https://datasheet.octopart.com/LTC6811HG-1%23PBF-Analog-Devices-datasheet-138896417.pdf?src-supplier=Upverter; ComponentLink4Description: https://datasheet.octopart.com/LTC6811HG-1%23PBF-Analog-Devices-datasheet-138896417.pdf?src-supplier=Upverter; ComponentLink5URL: https://datasheet.octopart.com/LTC6811HG-1%23PBF-Linear-Technology-datasheet-66874450.pdf?src-supplier=Linear+Technology; ComponentLink5Description: https://datasheet.octopart.com/LTC6811HG-1%23PBF-Linear-Technology-datasheet-66874450.pdf?src-supplier=Linear+Technology; ComponentLink6URL: https://sigma.octopart.com/57702806/technical_drawing/Linear-Technology-LTC6811HG-1%23PBF.pdf?src-supplier=Linear+Technology; ComponentLink6Description: https://sigma.octopart.com/57702806/technical_drawing/Linear-Technology-LTC6811HG-1%23PBF.pdf?src-supplier=Linear+Technology; Supplier Part Number 1: 505-LTC6811HG-1#PBF-ND; Case/Package: SSOP; Manufacturer Part Number 1: LTC6811-1

## Sheet [3]Temperatures.SchDoc
size A4; DocumentNumber: 4; SheetNumber: 4; SheetTotal: 5
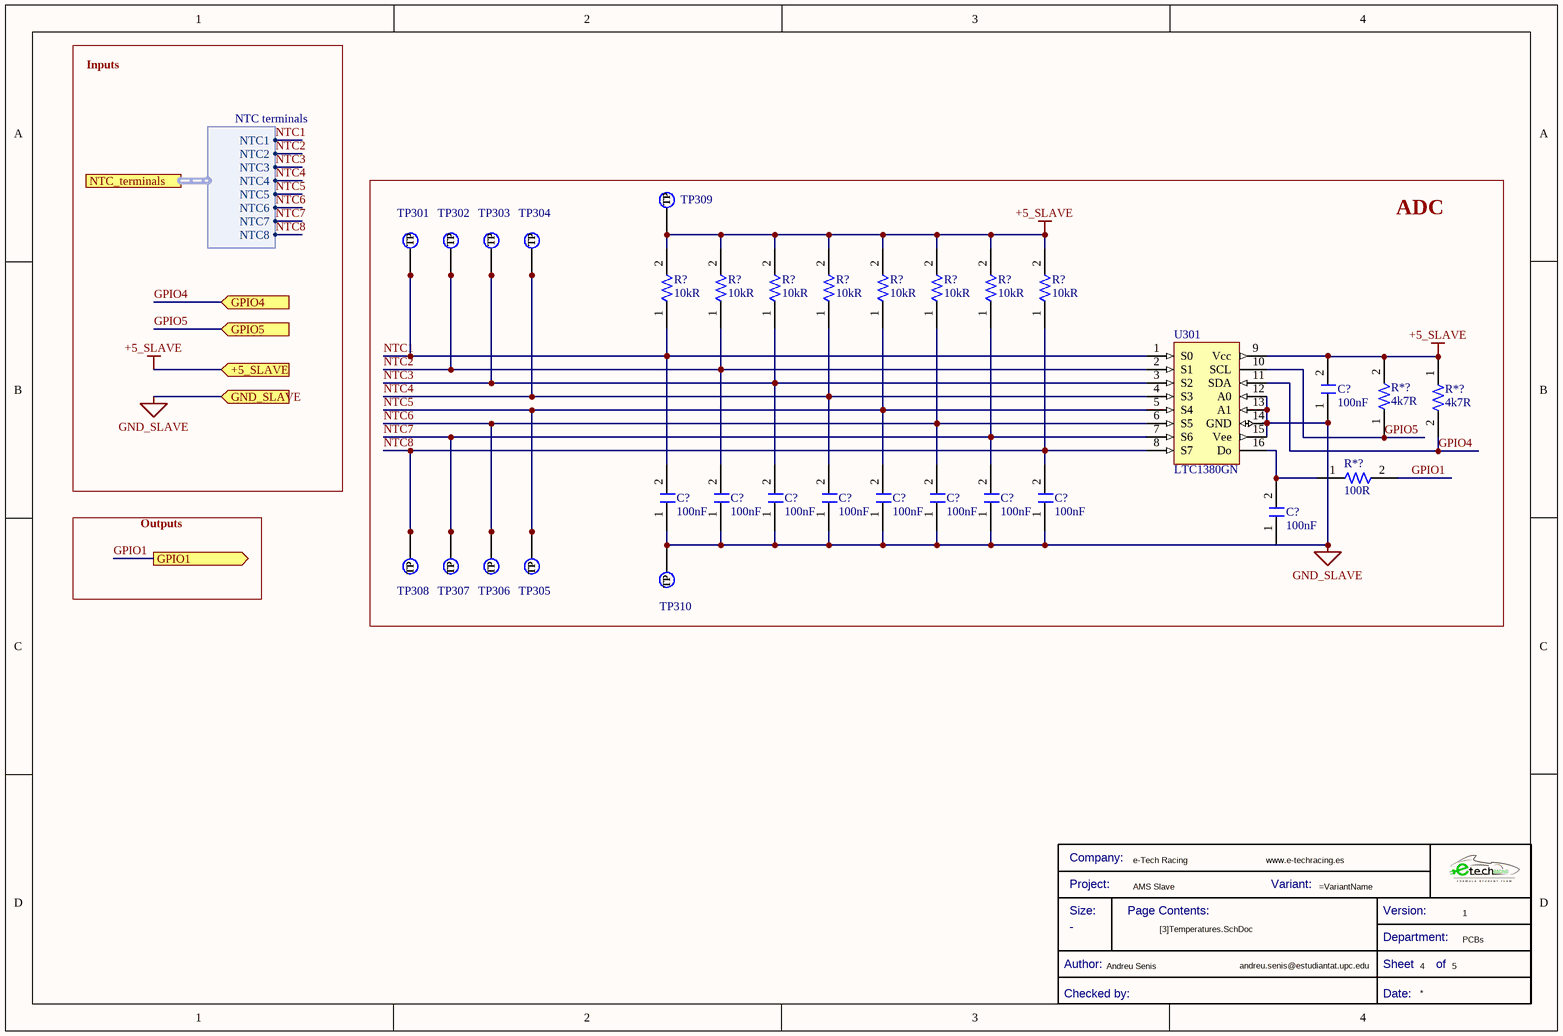
[diagram p3: [3]Temperatures.SchDoc]

### Parts
(Parts that share a designator on the sheet are numbered #1, #2 ... from top to bottom, then left to right.)
*?#3  Title Block_template  (value not drawn)  (graphical)
C?#18  Capacitance: 100nF  [C0805FNPC-R]  (hidden comment: 885012207098)
C?#19  Capacitance: 100nF  [C0805FNPC-R]  (hidden comment: 885012207098)
C?#20  Capacitance: 100nF  [C0805FNPC-R]  (hidden comment: 885012207098)
C?#21  Capacitance: 100nF  [C0805FNPC-R]  (hidden comment: 885012207098)
C?#22  Capacitance: 100nF  [C0805FNPC-R]  (hidden comment: 885012207098)
C?#23  Capacitance: 100nF  [C0805FNPC-R]  (hidden comment: 885012207098)
C?#24  Capacitance: 100nF  [C0805FNPC-R]  (hidden comment: 885012207098)
C?#25  Capacitance: 100nF  [C0805FNPC-R]  (hidden comment: 885012207098)
C?#26  Capacitance: 100nF  [C0805FNPC-R]  (hidden comment: 885012207098)
C?#27  Capacitance: 100nF  [C0805FNPC-R]  (hidden comment: 885012207098)
R*?#1  Resistance: 4k7R  [R0805FTK]  (hidden comment: CR0805-JW-472ELF)
R*?#2  Resistance: 4k7R  [R0805FTK]  (hidden comment: CR0805-JW-472ELF)
R*?#3  Resistance: 100R  [R0805FTK]  (hidden comment: CR0805-FX-1000ELF)
R?#38  Resistance: 10kR  [R0805FTK]  (hidden comment: CR0805-JW-103ELF)
R?#39  Resistance: 10kR  [R0805FTK]  (hidden comment: CR0805-JW-103ELF)
R?#40  Resistance: 10kR  [R0805FTK]  (hidden comment: CR0805-JW-103ELF)
R?#41  Resistance: 10kR  [R0805FTK]  (hidden comment: CR0805-JW-103ELF)
R?#42  Resistance: 10kR  [R0805FTK]  (hidden comment: CR0805-JW-103ELF)
R?#43  Resistance: 10kR  [R0805FTK]  (hidden comment: CR0805-JW-103ELF)
R?#44  Resistance: 10kR  [R0805FTK]  (hidden comment: CR0805-JW-103ELF)
R?#45  Resistance: 10kR  [R0805FTK]  (hidden comment: CR0805-JW-103ELF)
TP301  TestPoint  [TestPoint]  (value not drawn)  (no BOM)
TP302  TestPoint  [TestPoint]  (value not drawn)  (no BOM)
TP303  TestPoint  [TestPoint]  (value not drawn)  (no BOM)
TP304  TestPoint  [TestPoint]  (value not drawn)  (no BOM)
TP305  TestPoint  [TestPoint]  (value not drawn)  (no BOM)
TP306  TestPoint  [TestPoint]  (value not drawn)  (no BOM)
TP307  TestPoint  [TestPoint]  (value not drawn)  (no BOM)
TP308  TestPoint  [TestPoint]  (value not drawn)  (no BOM)
TP309  TestPoint  [TestPoint]  (value not drawn)  (no BOM)
TP310  TestPoint  [TestPoint]  (value not drawn)  (no BOM)
U301  LTC1380GN  [U_LTC1380GN]

### Blocks framed on the sheet
ADC: C?#18-C?#27 R*?#1-R*?#3 R?#38-R?#45 TP301-TP310 U301

### Ports
+5_SLAVE (in), GND_SLAVE (in), GPIO1 (out), GPIO4 (in), GPIO5 (in), NTC_terminals (harness NTC terminals)

### Harnesses
NTC terminals: NTC1, NTC2, NTC3, NTC4, NTC5, NTC6, NTC7, NTC8

### Nets
+5_SLAVE: C?#18.2 R*?#1.1 R*?#2.2 R?#38.2 R?#39.2 R?#40.2 R?#41.2 R?#42.2 R?#43.2 R?#44.2 R?#45.2 TP309.1(TP) U301.9(Vcc) ; port +5_SLAVE
GND_SLAVE: C?#18.1 C?#19.1 C?#20.1 C?#21.1 C?#22.1 C?#23.1 C?#24.1 C?#25.1 C?#26.1 C?#27.1 TP310.1(TP) U301.12(A0) U301.13(A1) U301.14(GND) U301.15(Vee) ; port GND_SLAVE  [project net C0]
GPIO1: R*?#3.2 ; port GPIO1
GPIO4: R*?#1.2 U301.11(SDA) ; port GPIO4
GPIO5: R*?#2.1 U301.10(SCL) ; port GPIO5
NTC1: C?#19.2 R?#38.1 TP301.1(TP) U301.1(S0) ; port NTC_terminals.NTC1
NTC2: C?#20.2 R?#39.1 TP302.1(TP) U301.2(S1) ; port NTC_terminals.NTC2
NTC3: C?#21.2 R?#40.1 TP303.1(TP) U301.3(S2) ; port NTC_terminals.NTC3
NTC4: C?#22.2 R?#41.1 TP304.1(TP) U301.4(S3) ; port NTC_terminals.NTC4
NTC5: C?#23.2 R?#42.1 TP305.1(TP) U301.5(S4) ; port NTC_terminals.NTC5
NTC6: C?#24.2 R?#43.1 TP306.1(TP) U301.6(S5) ; port NTC_terminals.NTC6
NTC7: C?#25.2 R?#44.1 TP307.1(TP) U301.7(S6) ; port NTC_terminals.NTC7
NTC8: C?#26.2 R?#45.1 TP308.1(TP) U301.8(S7) ; port NTC_terminals.NTC8
NetC?#27_2: C?#27.2 R*?#3.1 U301.16(Do)

### Notes on the sheet
- Inputs
- Outputs
- (in symbol Title Block_template) Company:; Project:; Variant:; Size:; Page Contents:; Version:; Department:; Author:; Sheet; of; Checked by:; Date:

### Library data of the parts
*?#3 = Title Block_template: Standard Title Block; .Creator: GP; Category: Title Block; .PCBcheck: GP; .SCHcheck: GP; Size: -
C?#18-C?#27 = C100n-50V-0805FNPC-X7R: as C?#1 on sheet [2]Balancing; Supplier 1: RSComponents; Manufacturer Part Number 1: 885012207098; RoHS: Yes; Category: Ceramic Capacitors; Stock 1: 8000; Pricing 1: 100=0,10200, 500=0,07100, 2000=0,06100 (GBP); Mount: Surface Mount; Case/Package: 0805; Case Code (Metric): 2012; Case Code (Imperial): 0805; Min Operating Temperature: -55°C; Max Operating Temperature: 125°C; Packaging: Cut Tape; Voltage Rating: 50V; Dielectric: X7R; Tolerance: 10%; Voltage Rating (DC): 50V; Length: 0.079inch; Width: 0.049inch; Thickness: 0.035inch; REACH SVHC: Unknown; RoHS Compliant: Yes; ComponentLink1URL: http://www.farnell.com/datasheets/1958498.pdf?src-supplier=Farnell; ComponentLink1Description: http://www.farnell.com/datasheets/1958498.pdf?src-supplier=Farnell; ComponentLink2URL: http://www.farnell.com/datasheets/1958498.pdf?src-supplier=Element14; ComponentLink2Description: http://www.farnell.com/datasheets/1958498.pdf?src-supplier=Element14; ComponentLink3URL: https://katalog.we-online.de/pbs/datasheet/885012207098.pdf?src-supplier=Digi-Key; ComponentLink3Description: https://katalog.we-online.de/pbs/datasheet/885012207098.pdf?src-supplier=Digi-Key; ComponentLink4URL: http://www.farnell.com/datasheets/1958498.pdf?src-supplier=Newark; ComponentLink4Description: http://www.farnell.com/datasheets/1958498.pdf?src-supplier=Newark; Supplier Part Number 1: 1813493
R*?#1 R*?#2 = R4.7K-0805FTK: Res Thick Film 0805 4.7K Ohm 5% 1/8W ±200ppm/°C Molded SMD SMD Paper Tape on Plastic Reel; Manufacturer 1: Bourns; Power Rating: 125mW; Voltage Rating: 150V; .Creator: DR; Supplier 1: Arrow Electronics; Manufacturer Part Number 1: CR0805-JW-472ELF; RoHS: Yes; Category: Chip SMD Resistors; Stock 1: 3734; Pricing 1: 1=0,05590, 10=0,01670, 25=0,01290, 100=0,00840, 250=0,00830, 500=0,00690, 1000=0,00410 (USD); Mount: Surface Mount; Case/Package: 0805; Case Code (Metric): 2012; Case Code (Imperial): 0805; Contact Plating: Tin; Min Operating Temperature: -55°C; Max Operating Temperature: 155°C; Packaging: Tape and Reel; Tolerance: 5%; Package Quantity: 1; Resistor Type: Thick Film; Number of Terminations: 2; Termination: SMD/SMT; Temperature Coefficient: 200ppm/°C; Max Power Dissipation: 125mW; Voltage Rating (DC): 150V; Features: Moisture Resistant; Series: CR0805; Resistance Tolerance: 5%; Construction: Rectangular; Length: 2mm; Width: 0.049inch; Height: 0.024inch; Depth: 1.25mm; Thickness: 508um; Radiation Hardening: No; REACH SVHC: No SVHC; Military Standard: Not; RoHS Compliant: Yes; ComponentLink1URL: https://datasheet.ciiva.com/5541/chpreztr-5541593.pdf?src-supplier=Mouser; ComponentLink1Description: https://datasheet.ciiva.com/5541/chpreztr-5541593.pdf?src-supplier=Mouser; ComponentLink2URL: https://datasheet.ciiva.com/6560/chpreztr-6560073.pdf?src-supplier=Digi-Key; ComponentLink2Description: https://datasheet.ciiva.com/6560/chpreztr-6560073.pdf?src-supplier=Digi-Key; ComponentLink3URL: https://datasheet.ciiva.com/6560/chpreztr-6560074.pdf?src-supplier=Digi-Key; ComponentLink3Description: https://datasheet.ciiva.com/6560/chpreztr-6560074.pdf?src-supplier=Digi-Key; ComponentLink4URL: https://datasheet.ciiva.com/30174/159chpreztr-30174252.pdf?src-supplier=Onlinecomponents.com; ComponentLink4Description: https://datasheet.ciiva.com/30174/159chpreztr-30174252.pdf?src-supplier=Onlinecomponents.com; ComponentLink5URL: https://datasheet.ciiva.com/9122/chpreztr-9122814.pdf?src-supplier=Avnet; ComponentLink5Description: https://datasheet.ciiva.com/9122/chpreztr-9122814.pdf?src-supplier=Avnet; ComponentLink6URL: https://datasheet.ciiva.com/22713/691949-22713272.pdf?src-supplier=Element14; ComponentLink6Description: https://datasheet.ciiva.com/22713/691949-22713272.pdf?src-supplier=Element14; ComponentLink7URL: https://datasheet.ciiva.com/6560/chpreztr-6560075.pdf?src-supplier=Digi-Key; ComponentLink7Description: https://datasheet.ciiva.com/6560/chpreztr-6560075.pdf?src-supplier=Digi-Key; Supplier Part Number 1: CR0805-JW-472ELF
R*?#3 = R100-0805FTK: as R?#1 on sheet [2]Balancing; Supplier 1: Arrow Electronics; Manufacturer Part Number 1: CR0805-FX-1000ELF; RoHS: Yes; Category: Chip SMD Resistors; Stock 1: 49802; Pricing 1: 1=0,05840, 10=0,03430, 25=0,01780, 100=0,00750, 250=0,00560, 500=0,00490, 3000=0,00470 (USD); Mount: Surface Mount; Case/Package: 0805; Number of Pins: 2; Contact Plating: Tin; Case Code (Imperial): 0805; Case Code (Metric): 2012; Min Operating Temperature: -55°C; Max Operating Temperature: 155°C; Tolerance: 1%; Resistor Type: Thick Film; Temperature Coefficient: 100ppm/°C; Packaging: Tape and Reel; Package Quantity: 1; Termination: SMD/SMT; Number of Terminations: 2; Max Power Dissipation: 125mW; Voltage Rating (DC): 150V; Features: Moisture Resistant; Series: CR0805; Resistance Tolerance: 1%; Construction: Rectangular; Technology: THICK FILM; Length: 2mm; Width: 1.25mm; Height: 0.5mm; Depth: 1.25mm; Thickness: 508um; Radiation Hardening: No; REACH SVHC: No SVHC; Military Standard: Not; RoHS Compliant: Yes; ComponentLink1URL: https://datasheet.ciiva.com/11809/0900766b80fcdb72-11809178.pdf?src-supplier=RSComponents; ComponentLink1Description: https://datasheet.ciiva.com/11809/0900766b80fcdb72-11809178.pdf?src-supplier=RSComponents; ComponentLink2URL: https://datasheet.ciiva.com/6547/chpreztr-6547413.pdf?src-supplier=Digi-Key; ComponentLink2Description: https://datasheet.ciiva.com/6547/chpreztr-6547413.pdf?src-supplier=Digi-Key; ComponentLink3URL: https://datasheet.ciiva.com/6547/chpreztr-6547414.pdf?src-supplier=Digi-Key; ComponentLink3Description: https://datasheet.ciiva.com/6547/chpreztr-6547414.pdf?src-supplier=Digi-Key; ComponentLink4URL: https://datasheet.ciiva.com/6547/chpreztr-6547415.pdf?src-supplier=Digi-Key; ComponentLink4Description: https://datasheet.ciiva.com/6547/chpreztr-6547415.pdf?src-supplier=Digi-Key; ComponentLink5URL: https://datasheet.ciiva.com/9120/chpreztr-9120744.pdf?src-supplier=Avnet; ComponentLink5Description: https://datasheet.ciiva.com/9120/chpreztr-9120744.pdf?src-supplier=Avnet; Supplier Part Number 1: CR0805-FX-1000ELF
R?#38-R?#45 = R10k-0805FTK: BOURNS         CR0805-JW-103ELF            Surface Mount Chip Resistor, Thick Film, CR Series, 10 kohm, 125 mW,  5%, 150 V; Temperature Coefficient: 200ppm/°C; Power Rating: 125mW; Voltage Rating: 150V; Voltage Rating (DC): 100V; .Creator: DR; Supplier 1: Arrow Electronics; Manufacturer 1: Bourns; Manufacturer Part Number 1: CR0805-JW-103ELF; RoHS: Yes; Category: Chip SMD Resistors; Stock 1: 57566; Pricing 1: 1=0,05790, 10=0,01540, 25=0,01340, 100=0,00340 (USD); Mount: Surface Mount; Case/Package: 0805; Number of Pins: 2; Contact Plating: Tin; Case Code (Metric): 2012; Case Code (Imperial): 0805; Min Operating Temperature: -55°C; Max Operating Temperature: 155°C; Tolerance: 5%; Resistor Type: Thick Film; Package Quantity: 1; Packaging: Tape and Reel; Number of Terminations: 2; Termination: SMD/SMT; Max Power Dissipation: 125mW; Features: Moisture Resistant; Series: CR0805; Construction: Rectangular; Resistance Tolerance: 5%; Technology: THICK FILM; Length: 2mm; Width: 1.25mm; Height: 0.5mm; Depth: 1.25mm; Thickness: 508um; Radiation Hardening: No; REACH SVHC: No SVHC; Military Standard: Not; RoHS Compliant: Yes; ComponentLink1URL: https://datasheet.ciiva.com/11821/0900766b80fcdb72-11821135.pdf?src-supplier=RSComponents; ComponentLink1Description: https://datasheet.ciiva.com/11821/0900766b80fcdb72-11821135.pdf?src-supplier=RSComponents; ComponentLink2URL: https://datasheet.ciiva.com/9122/chpreztr-9122374.pdf?src-supplier=Avnet; ComponentLink2Description: https://datasheet.ciiva.com/9122/chpreztr-9122374.pdf?src-supplier=Avnet; ComponentLink3URL: https://datasheet.ciiva.com/22693/1902866-22693254.pdf?src-supplier=Element14; ComponentLink3Description: https://datasheet.ciiva.com/22693/1902866-22693254.pdf?src-supplier=Element14; ComponentLink4URL: https://datasheet.ciiva.com/7986/691949-7986187.pdf?src-supplier=Element14; ComponentLink4Description: https://datasheet.ciiva.com/7986/691949-7986187.pdf?src-supplier=Element14; ComponentLink5URL: https://datasheet.ciiva.com/30065/159chpreztr-30065976.pdf?src-supplier=Onlinecomponents.com; ComponentLink5Description: https://datasheet.ciiva.com/30065/159chpreztr-30065976.pdf?src-supplier=Onlinecomponents.com; ComponentLink6URL: https://datasheet.ciiva.com/16783/70154685-16783482.pdf?src-supplier=Allied+Electronics; ComponentLink6Description: https://datasheet.ciiva.com/16783/70154685-16783482.pdf?src-supplier=Allied+Electronics; ComponentLink7URL: https://datasheet.ciiva.com/5548/chpreztr-5548491.pdf?src-supplier=Mouser; ComponentLink7Description: https://datasheet.ciiva.com/5548/chpreztr-5548491.pdf?src-supplier=Mouser; ComponentLink8URL: https://datasheet.ciiva.com/6559/chpreztr-6559900.pdf?src-supplier=Digi-Key; ComponentLink8Description: https://datasheet.ciiva.com/6559/chpreztr-6559900.pdf?src-supplier=Digi-Key; ComponentLink9URL: https://datasheet.ciiva.com/6559/chpreztr-6559901.pdf?src-supplier=Digi-Key; ComponentLink9Description: https://datasheet.ciiva.com/6559/chpreztr-6559901.pdf?src-supplier=Digi-Key; ComponentLink10URL: https://datasheet.ciiva.com/7985/1856384-7985869.pdf?src-supplier=Element14; ComponentLink10Description: https://datasheet.ciiva.com/7985/1856384-7985869.pdf?src-supplier=Element14; ComponentLink11URL: https://datasheet.ciiva.com/48692/001055517-da-01-en-smd-wid-cr0805-jw-103elf-10k-ohm-1-8w-48692118.pdf?src-supplier=Conrad; ComponentLink11Description: https://datasheet.ciiva.com/48692/001055517-da-01-en-smd-wid-cr0805-jw-103elf-10k-ohm-1-8w-48692118.pdf?src-supplier=Conrad; Supplier Part Number 1: CR0805-JW-103ELF
TP301-TP310 = TestPoint: Test Point 1x1 mm; .Creator: GP; Category: TestPoint; .PCBcheck: GP; .SCHcheck: GP
U301 = U_LTC1380GN